# EAGLE design OSO-MISC-21-008 Hiking Log (EAGLE 9.6.2)
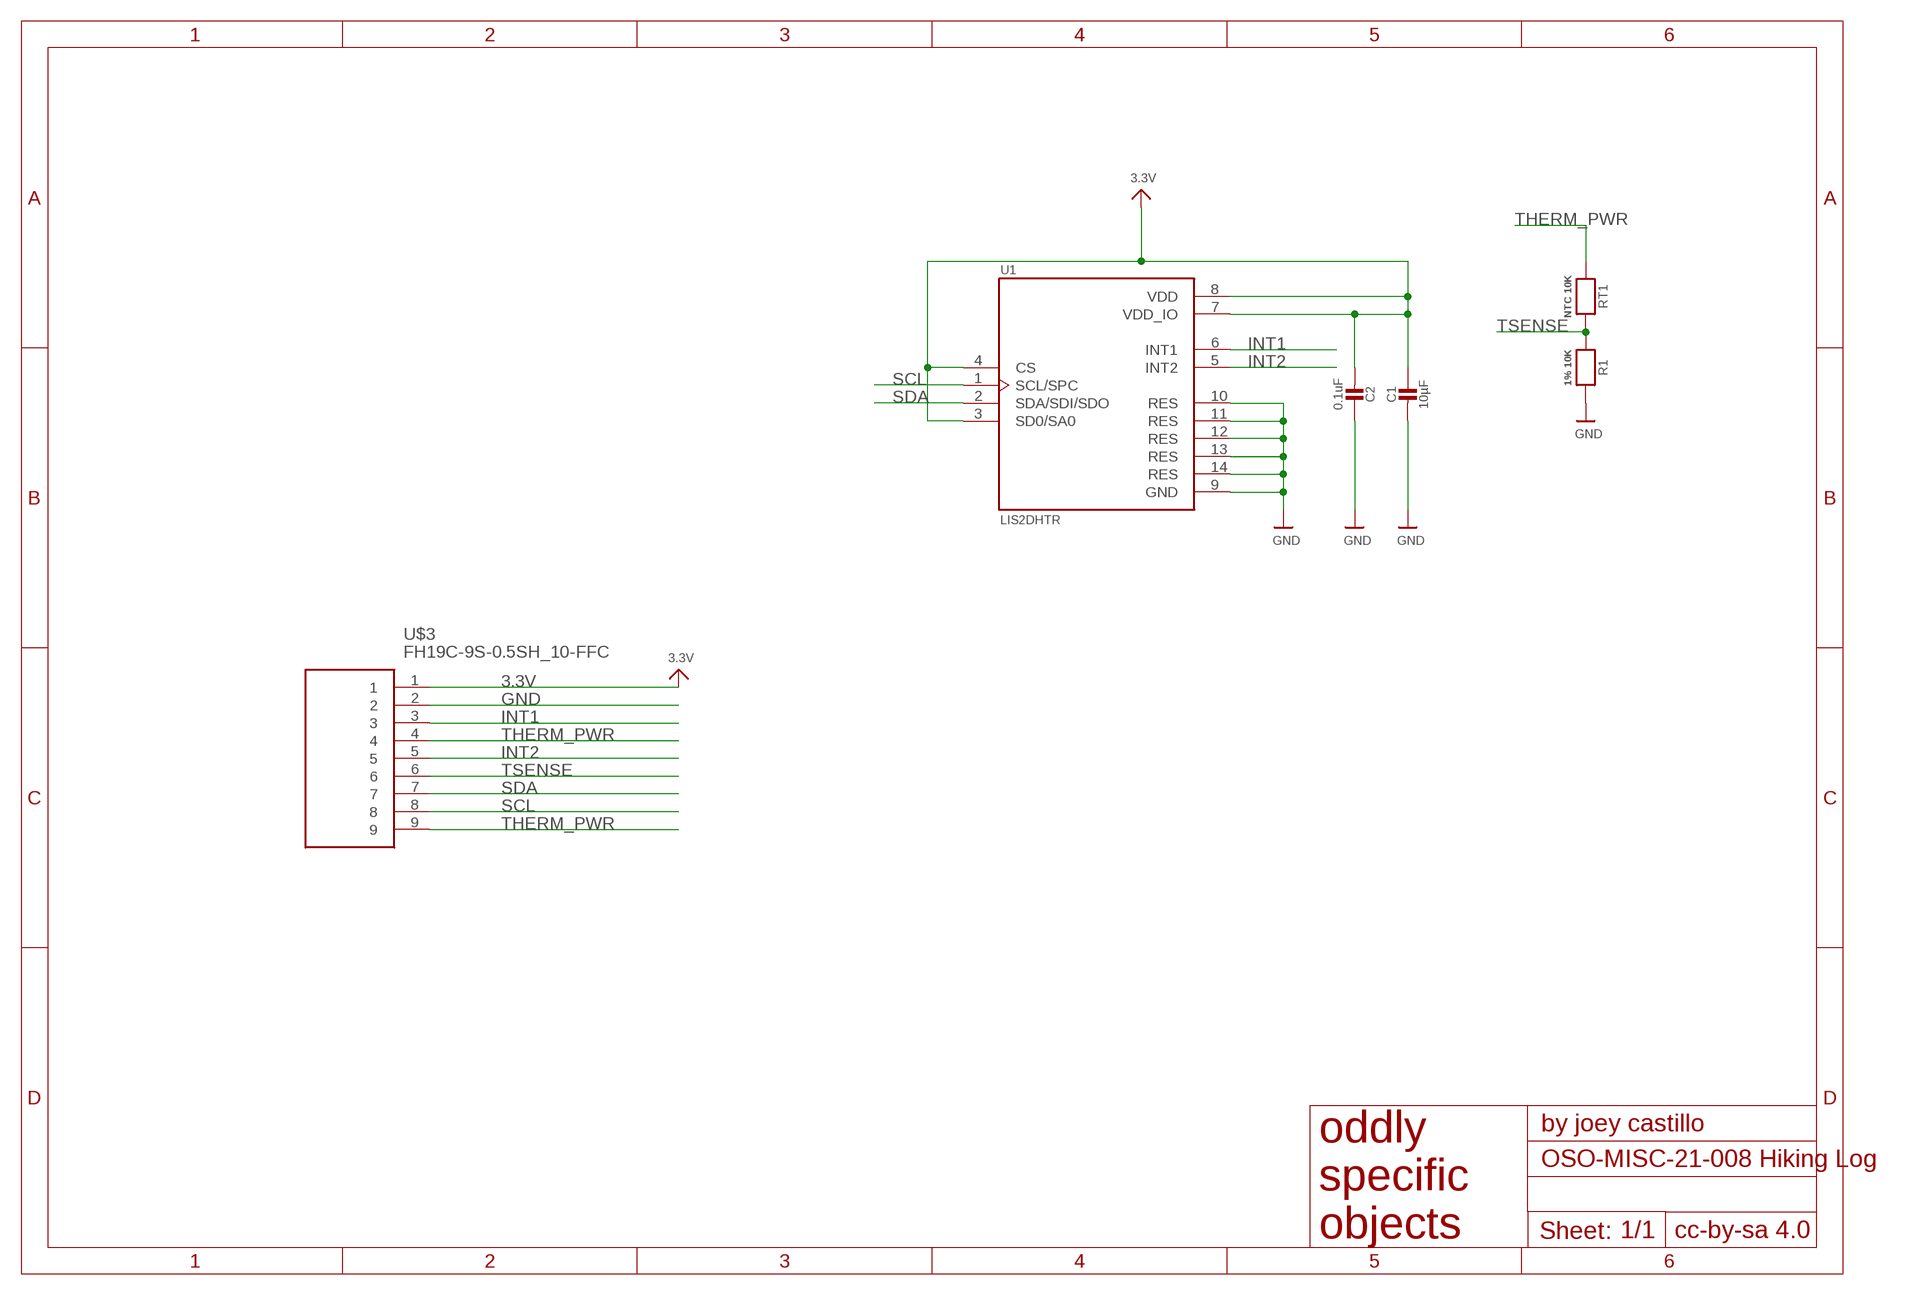
[diagram p0: schematic, sheet 1]

## Parts
C1  10µF  CAP_CERAMIC_0402MP  [_0402MP]
C2  0.1uF  CAP_CERAMIC_0402MP  [_0402MP]
R1  1% 10K  RESISTOR_0402MP  [_0402MP]
RT1  NTC 10K  RESISTOR_0402MP  [_0402MP]
U1  LIS2DHTR  [PQFN35P200X200X100-14N]
U$3  FH19C-9S-0.5SH_10-FFC  [FH19C9S05SH10-FFC]

## Nets
3.3V [power]: C1.1 C2.2 U1.3(SD0/SA0) U1.4(CS) U1.7(VDD_IO) U1.8(VDD) U$3.1
GND [gnd]: C1.2 C2.1 R1.2 U1.9(GND) U1.10(RES) U1.11(RES) U1.12(RES) U1.13(RES) U1.14(RES) U$3.2
INT1: U1.6(INT1) U$3.3
INT2: U1.5(INT2) U$3.5
SCL: U1.1(SCL/SPC) U$3.8
SDA: U1.2(SDA/SDI/SDO) U$3.7
THERM_PWR: RT1.1 U$3.4 U$3.9
TSENSE: R1.1 RT1.2 U$3.6

## Library data of the parts
C1 C2 = microbuilder:CAP_CERAMIC: Ceramic Capacitors For new designs, use the packages preceded by an '_' character since they are more reliable: The following footprints should be used on most boards: _0402 - Standard footprint for regular board layouts _0603 - Standard footprint for regular board layouts _0805 - Standard footprint for regular board layouts _1206 - Standard footprint for regular board layouts For extremely tight-pitch boards where space is at a premium, the following 'micro-pitch' footprints can be used (smaller pads, no silkscreen outline, etc.): _0402MP - Micro-pitch footprint for very dense/compact boards _0603MP - Micro-pitch footprint for very dense/compact boards _0805MP - Micro-pitch footprint for very dense/compact boards _1206MP - Micro-pitch footprint for very dense/compact boards
R1 RT1 = microbuilder:RESISTOR: Resistors For new designs, use the packages preceded by an '_' character since they are more reliable: The following footprints should be used on most boards: _0402 - Standard footprint for regular board layouts _0603 - Standard footprint for regular board layouts _0805 - Standard footprint for regular board layouts _1206 - Standard footprint for regular board layouts For extremely tight-pitch boards where space is at a premium, the following 'micro-pitch' footprints can be used (smaller pads, no silkscreen outline, etc.): _0402MP - Micro-pitch footprint for very dense/compact boards _0603MP - Micro-pitch footprint for very dense/compact boards _0805MP - Micro-pitch footprint for very dense/compact boards _1206MP - Micro-pitch footprint for very dense/compact boards
U1 = LIS2DHTR:LIS2DHTR: MEMS digital output motion sensor: ultra low-power high performance 3-axes femto accelerometer; DESCRIPTION: Accelerometer X, Y, Z Axis ±2g, 4g, 8g, 16g 0.5Hz ~ 672Hz 14-LGA _2x2_; DIGI-KEY_PART_NUMBER: 497-13795-1-ND; DIGI-KEY_PURCHASE_URL: https://www.digikey.com/product-detail/en/stmicroelectronics/LIS2DHTR/497-13795-1-ND/4209308?utm_source=snapeda&utm_medium=aggregator&utm_campaign=symbol; MF: STMicroelectronics; MP: LIS2DHTR; PACKAGE: LGA-14 STMicroelectronics
U$3 = FH19C-9S-0.5SH:FH19C-9S-0.5SH_10-FFC

## Net classes
0 default: width 0.203 mm
1 power: width 0.203 mm
2 gnd: width 0.203 mm

## Board
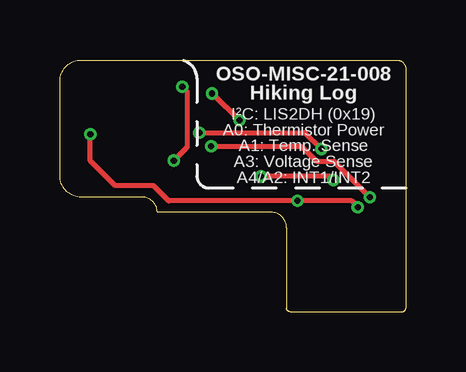
[diagram p1: board, top side]
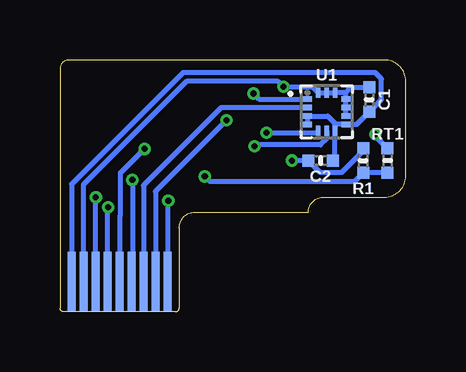
[diagram p2: board, bottom side, seen from below]

Size 14.43 x 10.48 mm. Coordinates in mm from the lower left corner, seen from the top.
Outline: 9.45,3.5 arc90 8.81,4.14 4.06,4.14 arc90 3.43,4.77 0.89,4.77 arc-90 0,5.66 0,9.6 arc-90 0.89,10.48 14.05,10.48 arc-90 14.43,10.1 14.43,3.5
Copper layers (1*16): Top 0.035559375mm / dielectric 4mil / Bottom 0.035559375mm
Design rules "oshpark-2layer *": minimum track width 6mil, minimum drill 10mil, track to track 6mil, track to pad 6mil, pad to pad 6mil, via to via 6mil, smd to smd 6mil, copper to edge 15mil, drill to drill 6mil, minimum pad ring 5mil, minimum via ring 5mil, stop-mask expansion 2.5mil, vias tented up to drill 12mil, thermal gap 10mil

### Footprints (pad centres in the part's own frame; a part is rotated, then mirrored left to right if it is on the bottom)
_0402MP = smd 0.5 x 0.5: 1 -0.508,0; 2 0.508,0
PQFN35P200X200X100-14N = smd 0.39 x 0.2: 1 -0.795,0.525; 2 -0.795,0.175; 3 -0.795,-0.175; 4 -0.795,-0.525; 8 0.795,-0.525; 9 0.795,-0.175; 10 0.795,0.175; 11 0.795,0.525 | smd 0.2 x 0.39: 5 -0.35,-0.795; 6 0,-0.795; 7 0.35,-0.795; 12 0.35,0.795; 13 0,0.795; 14 -0.35,0.795
FH19C9S05SH10-FFC = smd 0.347 x 2.5 bottom: 1 2,-2.25; 2 1.5,-2.25; 3 1,-2.25; 4 0.5,-2.25; 5 0,-2.25; 6 -0.5,-2.25; 7 -1,-2.25; 8 -1.5,-2.25; 9 -2,-2.25

### Placement (x,y rotation side)
C1  1.52,8.83 90 bottom
C2  3.56,6.29 0 bottom
R1  1.78,6.29 90 bottom
RT1  0.76,6.29 270 bottom
U1  3.3,8.33 0 bottom
U$3  11.94,3.5 0 top

### Tracks (layer width: path | path; a pad name or v marks a point on that pad's centre or on a via)
3.3V
  Bottom 0.203: U1.7 2.95,7.81 2.93,7.83 3.25,8.15 U1.3 U1.4 | U1.7 2.95,7.8 U1.8 2.05,7.8 C1.1 1.02,8.83 1.02,9.7 1.28,9.96 9.29,9.96 13.94,5.31 U$3.1 | C2.2 2.95,6.39 U1.7
GND  (via drill 0.25)
  Top 0.203: v4.75,6.29 5.31,6.85 5.31,9.17 v5.11,9.37
  Bottom 0.203: U1.9 U1.10 U1.11 2.51,9.12 | 2.51,9.12 U1.12 U1.13 U1.14 3.9,9.37 v5.11,9.37 5.33,9.6 9.14,9.6 13.44,5.3 U$3.2 | v4.75,6.29 C2.1 3.56,5.79 2.69,5.79 1.78,6.71 R1.2 | 2.51,9.12 2.29,9.34 C1.2
INT1  (via drill 0.25)
  Top 0.203: v6.31,6.89 10.07,6.89 10.69,6.27 11.43,6.27 v12.93,4.77
  Bottom 0.203: U1.6 3.3,7.21 3.56,6.95 6.25,6.95 v6.31,6.89 | U$3.3 12.96,1.27 12.96,4.75 v12.93,4.77
INT2  (via drill 0.25)
  Top 0.203: v5.82,7.46 10.22,7.46 v10.9,6.78
  Bottom 0.203: U1.5 3.75,7.44 5.8,7.44 v5.82,7.46 | v10.9,6.78 11.91,5.77 11.91,4.01 | 11.91,4.01 11.91,1.28 U$3.5 | 11.91,4.01
SCL  (via drill 0.25)
  Top 0.203: v6.35,9.09 6.37,9.09 v7.48,7.97
  Bottom 0.203: v6.35,9.09 6.12,8.86 4.12,8.86 U1.1 | v7.48,7.97 10.44,5.02 U$3.8
SDA
  Bottom 0.203: U1.2 7.7,8.5 10.94,5.26 U$3.7
THERM_PWR  (via drill 0.25)
  Top 0.203: v12.42,4.35 12.42,4.37 12.17,4.62 v9.91,4.62 4.53,4.62 3.9,5.25 2.31,5.25 1.27,6.29 v1.27,7.39
  Bottom 0.203: U$3.4 12.44,4.33 v12.42,4.35 | v1.27,7.39 1.27,7.31 RT1.1 | U$3.9 9.93,4.59 v9.91,4.62
TSENSE  (via drill 0.25)
  Top 0.203: v8.38,5.63 11.26,5.63 v11.41,5.49
  Bottom 0.203: RT1.2 R1.1 2.13,5.43 8.18,5.43 v8.38,5.63 | v11.41,5.49 11.41,1.28 U$3.6

### Text on the board
tPlace: OSO-MISC-21-008 / Hiking Log | I²C: LIS2DH (0x19) / A0: Thermistor Power / A1: Temp. Sense / A3: Voltage Sense / A4/A2: INT1/INT2